# Altium schematic sheet UserInterface.SchDoc
size A4
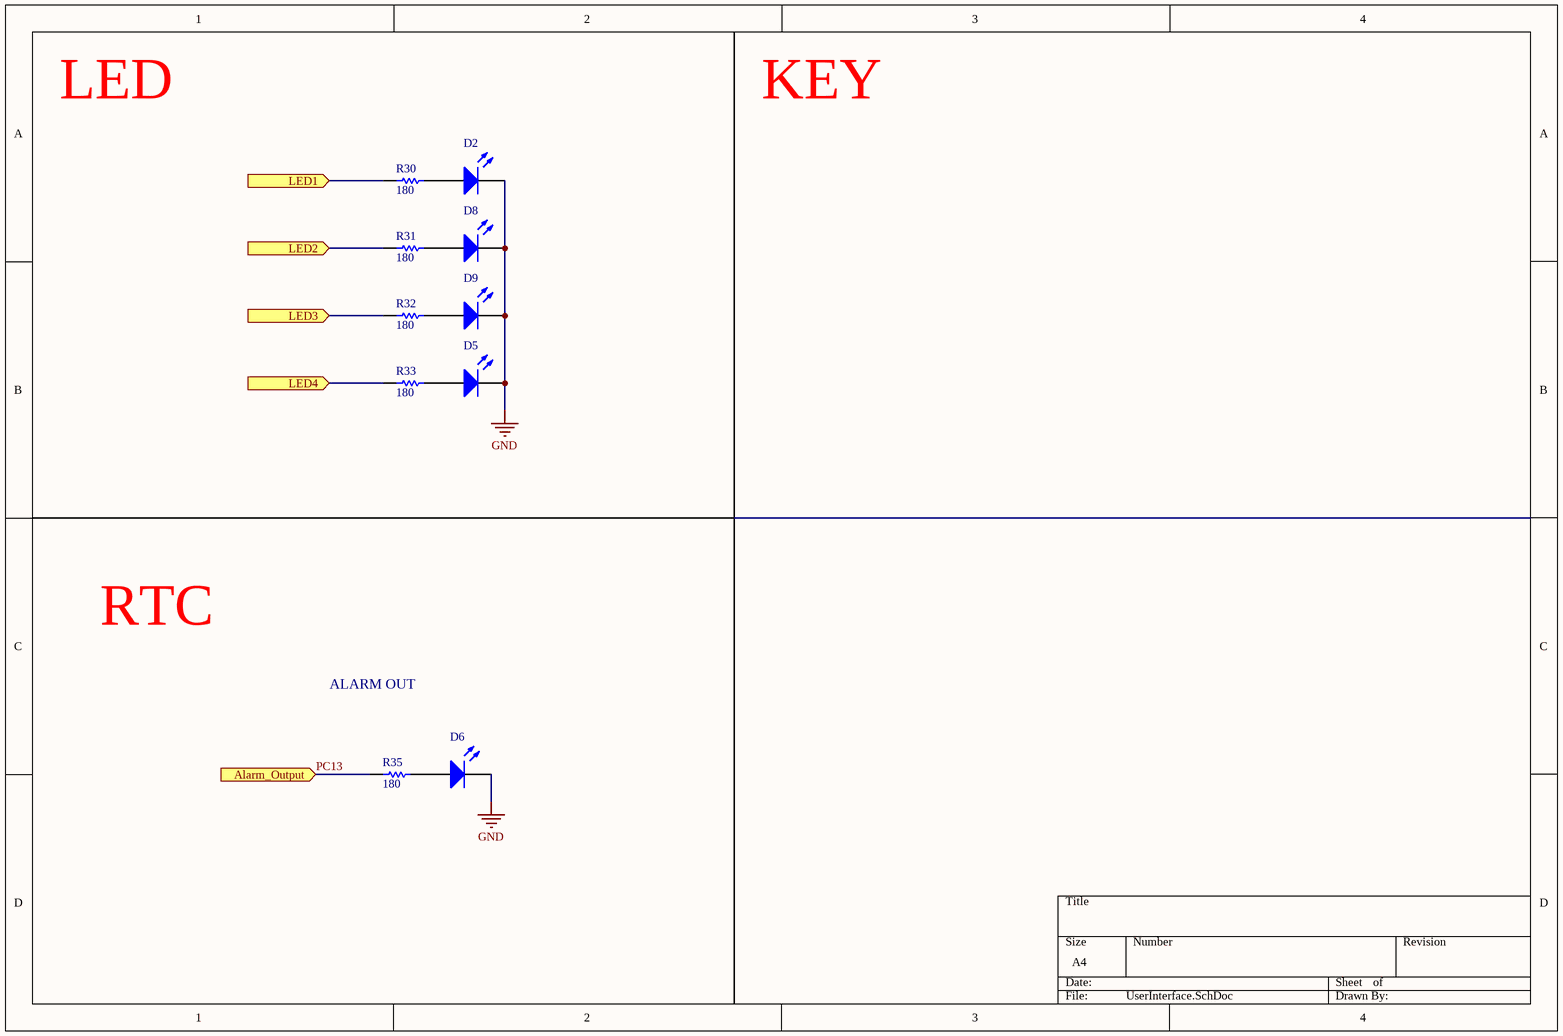
[diagram p0: UserInterface.SchDoc]

## Parts
D2  LED3  [LED-1206]  (value not drawn)
D5  LED3  [LED-1206]  (value not drawn)
D6  LED3  [LED-1206]  (value not drawn)
D8  LED3  [LED-1206]  (value not drawn)
D9  LED3  [LED-1206]  (value not drawn)
R30  180  [1206]
R31  180  [1206]
R32  180  [1206]
R33  180  [1206]
R35  180  [1206]

## Ports
Alarm_Output (in), LED1 (in), LED2 (in), LED3 (in), LED4 (in)

## Nets
GND: D2.2(K) D5.2(K) D6.2(K) D8.2(K) D9.2(K)
LED1: R30.1 ; port LED1
LED2: R31.1 ; port LED2
LED3: R32.1 ; port LED3
LED4: R33.1 ; port LED4
PC13: R35.1 ; port Alarm_Output
NetD2_1: D2.1(A) R30.2
NetD5_1: D5.1(A) R33.2
NetD6_1: D6.1(A) R35.2
NetD8_1: D8.1(A) R31.2
NetD9_1: D9.1(A) R32.2

## Notes on the sheet
- LED
- KEY
- RTC
- ALARM OUT

## Library data of the parts
D2 D5 D6 D8 D9 = LED3: Typical BLUE SiC LED; Published: 8-Jun-2000; LatestRevisionDate: 17-Dec-2003; LatestRevisionNote: PCB Footprint replaced.; DatasheetVersion: 16-Apr-2002; PackageVersion: 16-Apr-2002; PackageReference: 3.5X2.8X1.9; Publisher: Altium Limited
R30-R33 R35 = Res Semi: Semiconductor Resistor; Value: 27; Published: 8-Jun-2000; LatestRevisionDate: 17-Jul-2002; LatestRevisionNote: Re-released for DXP Platform.; PackageReference: AXIAL-0.5; Publisher: Altium Limited